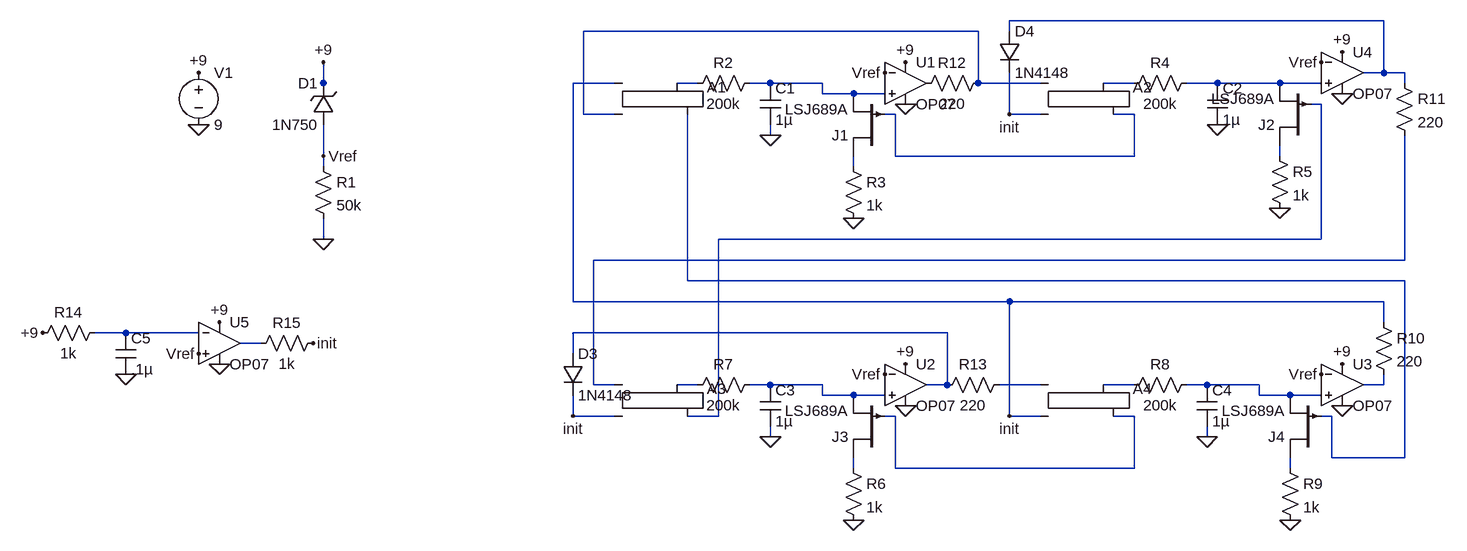
[diagram p0: schematic SR LFO general idea.asc]
SR LFO general idea.asc, the LTspice schematic file:
Version 4
SHEET 1 1316 824
WIRE 1216 16 640 16
WIRE 592 32 -16 32
WIRE 640 32 640 16
WIRE 1216 96 1216 16
WIRE 1216 96 1184 96
WIRE 1248 96 1216 96
WIRE -416 112 -416 80
WIRE 32 112 -32 112
WIRE 160 112 128 112
WIRE 272 112 240 112
WIRE 352 112 272 112
WIRE 592 112 592 32
WIRE 688 112 592 112
WIRE 832 112 784 112
WIRE 960 112 912 112
WIRE 1056 112 960 112
WIRE 1120 112 1056 112
WIRE 1248 112 1248 96
WIRE -416 128 -416 112
WIRE 352 128 352 112
WIRE 400 128 352 128
WIRE 448 128 400 128
WIRE 1120 144 1104 144
WIRE -16 160 -16 32
WIRE 32 160 -16 160
WIRE 464 160 448 160
WIRE 640 160 640 96
WIRE 688 160 640 160
WIRE 832 160 800 160
WIRE 272 192 272 176
WIRE -416 224 -416 176
WIRE 464 224 464 160
WIRE 832 224 832 160
WIRE 832 224 464 224
WIRE 1056 224 1056 208
WIRE -416 240 -416 224
WIRE 400 240 400 224
WIRE -416 352 -416 320
WIRE 1120 352 1120 144
WIRE 1120 352 192 352
WIRE 1248 384 1248 192
WIRE 1248 384 0 384
WIRE 144 416 144 160
WIRE 1248 416 144 416
WIRE -32 448 -32 112
WIRE 640 448 -32 448
WIRE 1216 448 640 448
WIRE 1216 480 1216 448
WIRE -720 496 -768 496
WIRE -608 496 -720 496
WIRE 544 496 -32 496
WIRE -512 512 -544 512
WIRE -32 528 -32 496
WIRE 0 576 0 384
WIRE 32 576 0 576
WIRE 160 576 128 576
WIRE 272 576 240 576
WIRE 352 576 272 576
WIRE 544 576 544 496
WIRE 544 576 512 576
WIRE 688 576 624 576
WIRE 832 576 784 576
WIRE 944 576 912 576
WIRE 1024 576 944 576
WIRE 1216 576 1216 560
WIRE 1216 576 1184 576
WIRE 352 592 352 576
WIRE 400 592 352 592
WIRE 448 592 400 592
WIRE 1024 592 1024 576
WIRE 1072 592 1024 592
WIRE 1120 592 1072 592
WIRE -32 624 -32 592
WIRE 32 624 -32 624
WIRE 192 624 192 352
WIRE 192 624 144 624
WIRE 464 624 448 624
WIRE 640 624 640 448
WIRE 688 624 640 624
WIRE 832 624 800 624
WIRE 1136 624 1120 624
WIRE 272 656 272 640
WIRE 944 656 944 640
WIRE 1136 688 1136 624
WIRE 1248 688 1248 416
WIRE 1248 688 1136 688
WIRE 400 704 400 688
WIRE 464 704 464 624
WIRE 832 704 832 624
WIRE 832 704 464 704
WIRE 1072 704 1072 688
FLAG -608 176 0
FLAG -416 80 +9
FLAG -608 96 +9
FLAG -416 352 0
FLAG -416 224 Vref
FLAG -576 480 +9
FLAG 480 80 +9
FLAG 1152 64 +9
FLAG 448 96 Vref
FLAG 1120 80 Vref
FLAG -608 528 Vref
FLAG 272 192 0
FLAG 480 144 0
FLAG 400 320 0
FLAG 1056 304 0
FLAG 1152 128 0
FLAG 960 176 0
FLAG 480 544 +9
FLAG 448 560 Vref
FLAG 272 656 0
FLAG 480 608 0
FLAG 400 784 0
FLAG 640 160 init
FLAG -32 624 init
FLAG 640 624 init
FLAG 1152 544 +9
FLAG 1120 560 Vref
FLAG 944 656 0
FLAG 1152 608 0
FLAG 1072 784 0
FLAG -576 544 0
FLAG -848 496 +9
FLAG -720 560 0
FLAG -432 512 init
SYMBOL Digital\\srflop 80 64 R0
SYMATTR InstName A1
SYMBOL Digital\\srflop 736 64 R0
SYMATTR InstName A2
SYMBOL Digital\\srflop 80 528 R0
SYMATTR InstName A3
SYMBOL Digital\\srflop 736 528 R0
SYMATTR InstName A4
SYMBOL Opamps\\OP07 480 48 R0
SYMATTR InstName U1
SYMBOL Opamps\\OP07 1152 32 R0
SYMATTR InstName U4
SYMBOL res -432 224 R0
SYMATTR InstName R1
SYMATTR Value 50k
SYMBOL voltage -608 80 R0
WINDOW 123 0 0 Left 0
WINDOW 39 0 0 Left 0
SYMATTR InstName V1
SYMATTR Value 9
SYMBOL zener -400 176 R180
WINDOW 0 24 64 Left 2
WINDOW 3 24 0 Left 2
SYMATTR InstName D1
SYMATTR Value 1N750
SYMATTR Description Diode
SYMATTR Type diode
SYMBOL Opamps\\OP07 -576 448 R0
SYMATTR InstName U5
SYMBOL res 256 96 R90
WINDOW 0 0 56 VBottom 2
WINDOW 3 32 56 VTop 2
SYMATTR InstName R2
SYMATTR Value 200k
SYMBOL cap 256 112 R0
SYMATTR InstName C1
SYMATTR Value 1µ
SYMBOL res 384 224 R0
SYMATTR InstName R3
SYMATTR Value 1k
SYMBOL pjf 448 224 R180
SYMATTR InstName J1
SYMATTR Value LSJ689A
SYMBOL res 928 96 R90
WINDOW 0 0 56 VBottom 2
WINDOW 3 32 56 VTop 2
SYMATTR InstName R4
SYMATTR Value 200k
SYMBOL cap 944 112 R0
SYMATTR InstName C2
SYMATTR Value 1µ
SYMBOL pjf 1104 208 R180
SYMATTR InstName J2
SYMATTR Value LSJ689A
SYMBOL res 1040 208 R0
SYMATTR InstName R5
SYMATTR Value 1k
SYMBOL Opamps\\OP07 480 512 R0
SYMATTR InstName U2
SYMBOL cap 256 576 R0
SYMATTR InstName C3
SYMATTR Value 1µ
SYMBOL res 384 688 R0
SYMATTR InstName R6
SYMATTR Value 1k
SYMBOL pjf 448 688 R180
SYMATTR InstName J3
SYMATTR Value LSJ689A
SYMBOL res 256 560 R90
WINDOW 0 0 56 VBottom 2
WINDOW 3 32 56 VTop 2
SYMATTR InstName R7
SYMATTR Value 200k
SYMBOL diode -48 528 R0
SYMATTR InstName D3
SYMATTR Value 1N4148
SYMBOL diode 624 32 R0
SYMATTR InstName D4
SYMATTR Value 1N4148
SYMBOL Opamps\\OP07 1152 512 R0
SYMATTR InstName U3
SYMBOL res 928 560 R90
WINDOW 0 0 56 VBottom 2
WINDOW 3 32 56 VTop 2
SYMATTR InstName R8
SYMATTR Value 200k
SYMBOL cap 928 576 R0
SYMATTR InstName C4
SYMATTR Value 1µ
SYMBOL res 1056 688 R0
SYMATTR InstName R9
SYMATTR Value 1k
SYMBOL pjf 1120 688 R180
SYMATTR InstName J4
SYMATTR Value LSJ689A
SYMBOL res 1200 464 R0
SYMATTR InstName R10
SYMATTR Value 220
SYMBOL res 1232 96 R0
SYMATTR InstName R11
SYMATTR Value 220
SYMBOL res 608 96 R90
WINDOW 0 0 56 VBottom 2
WINDOW 3 32 56 VTop 2
SYMATTR InstName R12
SYMATTR Value 220
SYMBOL res 640 560 R90
WINDOW 0 0 56 VBottom 2
WINDOW 3 32 56 VTop 2
SYMATTR InstName R13
SYMATTR Value 220
SYMBOL res -752 480 R90
WINDOW 0 0 56 VBottom 2
WINDOW 3 32 56 VTop 2
SYMATTR InstName R14
SYMATTR Value 1k
SYMBOL cap -736 496 R0
SYMATTR InstName C5
SYMATTR Value .1µ
SYMBOL res -416 496 R90
WINDOW 0 0 56 VBottom 2
WINDOW 3 32 56 VTop 2
SYMATTR InstName R15
SYMATTR Value 1k

The netlist it stands for:
* SR LFO general idea.asc
A1 init N002 0 0 0 N012 N003 0 SRFLOP
A2 N002 init 0 0 0 N008 N005 0 SRFLOP
A3 N011 init 0 0 0 N007 N016 0 SRFLOP
A4 N018 init 0 0 0 N022 N019 0 SRFLOP
XU1 N004 Vref +9 0 P001 LT1001  ; OP07, pins In+ In- V+ V- OUT
XU4 N006 Vref +9 0 N001 LT1001  ; OP07, pins In+ In- V+ V- OUT
R1 Vref 0 50k
V1 +9 0 9
D1 Vref +9 1N750
XU5 Vref N013 +9 0 N015 LT1001  ; OP07, pins In+ In- V+ V- OUT
R2 N004 N003 200k
C1 N004 0 1µ
R3 N010 0 1k
J1 N010 N008 N004 LSJ689A
R4 N006 N005 200k
C2 N006 0 1µ
J2 N009 N007 N006 LSJ689A
R5 N009 0 1k
XU2 N017 Vref +9 0 N014 LT1001  ; OP07, pins In+ In- V+ V- OUT
C3 N017 0 1µ
R6 N023 0 1k
J3 N023 N022 N017 LSJ689A
R7 N017 N016 200k
D3 N014 init 1N4148
D4 N001 init 1N4148
XU3 N020 Vref +9 0 N021 LT1001  ; OP07, pins In+ In- V+ V- OUT
R8 N020 N019 200k
C4 N020 0 1µ
R9 N024 0 1k
J4 N024 N012 N020 LSJ689A
R10 init N021 220
R11 N001 N011 220
R12 N002 P001 220
R13 N018 N014 220
R14 N013 +9 1k
C5 N013 0 .1µ
R15 init N015 1k
.model D D
.lib standard.dio
.model NJF NJF
.model PJF PJF
.lib standard.jft
.lib LTC.lib
.backanno
.end